# Altium schematic sheet BASE(1).SchDoc
size A4
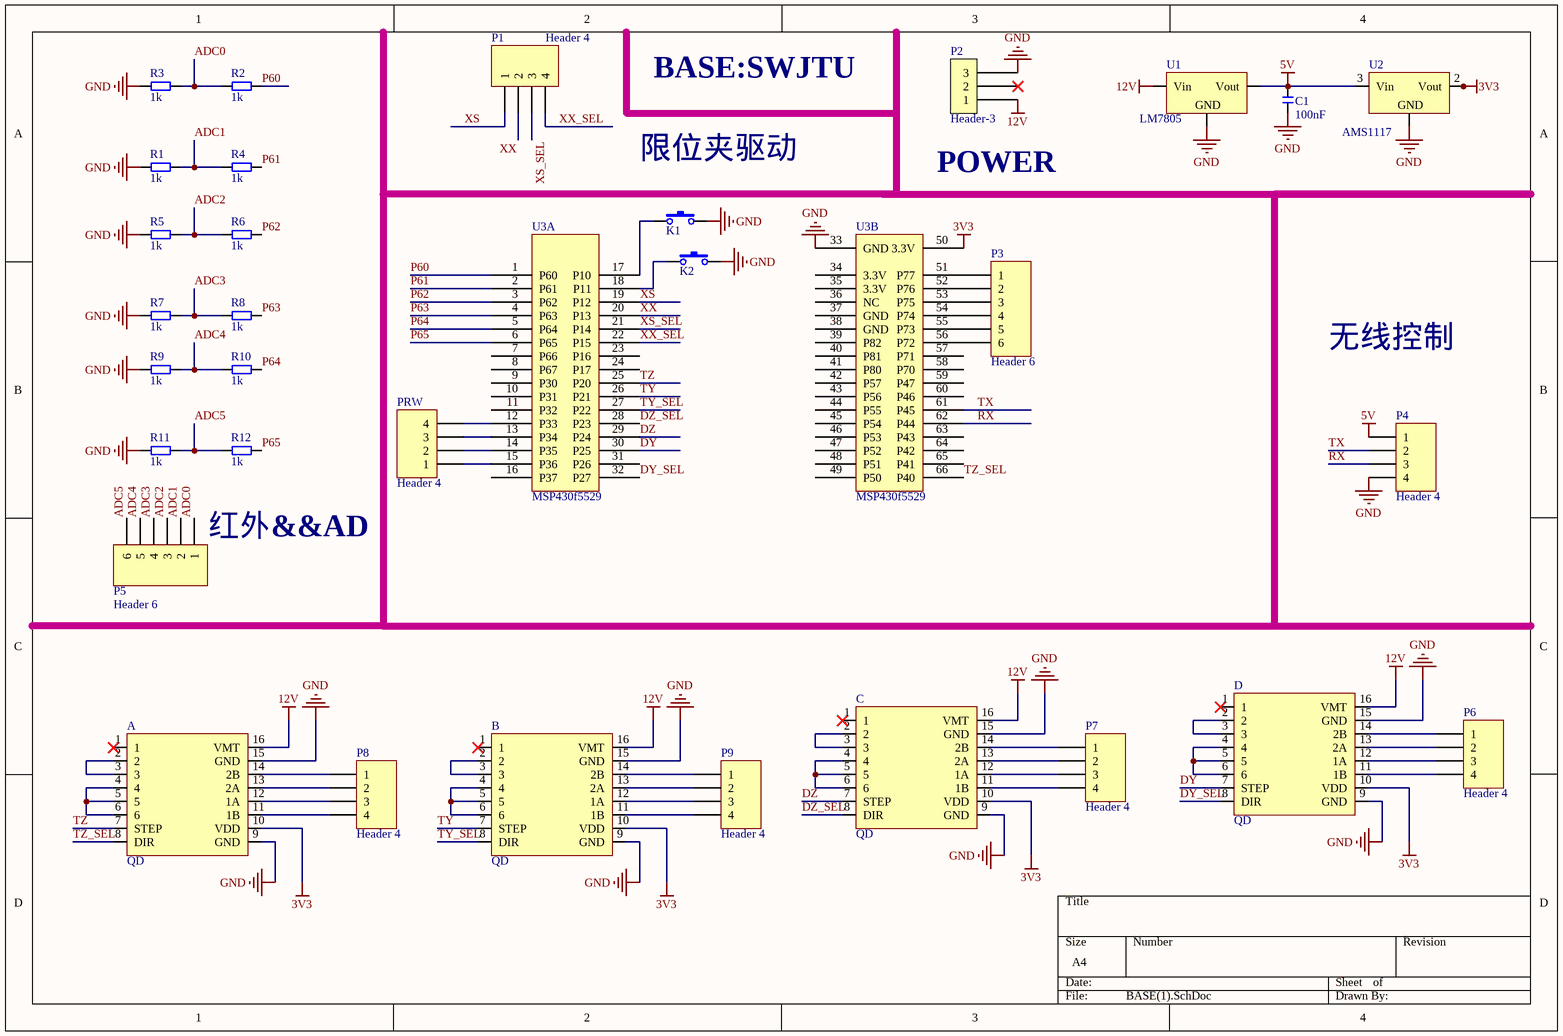
[diagram p0: BASE(1).SchDoc]

## Parts
A  QD  [QD]
B  QD  [QD]
C  QD  [QD]
C1  100nF  [CAP-7.6]
D  QD  [QD]
K1  SW-PB  [SW-4]  (value not drawn)
K2  SW-PB  [SW-4]  (value not drawn)
P1  Header 4  [4PIN-2.54 A]
P2  Header-3  [terminal-03-3]
P3  Header 6  [HDR1X6]
P4  Header 4  [4PIN-2.54 A]
P5  Header 6  [HDR1X6]
P6  Header 4  [4PIN-2.54 A]
P7  Header 4  [4PIN-2.54 A]
P8  Header 4  [4PIN-2.54 A]
P9  Header 4  [4PIN-2.54 A]
PRW  Header 4  [4PIN-2.54 A]
R1  1k  [Axial-0.3-7.62]
R2  1k  [R0805]
R3  1k  [R0805]
R4  1k  [R0805]
R5  1k  [Axial-0.3-7.62]
R6  1k  [R0805]
R7  1k  [Axial-0.3-7.62]
R8  1k  [R0805]
R9  1k  [Axial-0.3-7.62]
R10  1k  [R0805]
R11  1k  [R0805]
R12  1k  [R0805]
U1  LM7805  [TO-220]
U2  AMS1117  [SOT-223]
U3  MSP430f5529  [msp430f5529]  (parts A,B of 2)

## Nets
3V3: A.10(VDD) B.10(VDD) C.10(VDD) D.10(VDD) U2.2(Vout) U2.4(Vout) U3.50(3.3V)
5V: C1.2 P4.1 U1.3(Vout) U2.3(Vin)
12V: A.16(VMT) B.16(VMT) C.16(VMT) D.16(VMT) P2.1 U1.1(Vin)
GND: A.9(GND) A.15(GND) B.9(GND) B.15(GND) C.9(GND) C.15(GND) C1.1 D.9(GND) D.15(GND) K1.2 K2.2 P2.3 P4.4 R1.1 R3.1 R5.1 R7.1 R9.1 R11.1 U1.2(GND) U2.1(GND) U3.33(GND)
ADC0: P5.1 R2.1 R3.2
ADC1: P5.2 R1.2 R4.1
ADC2: P5.3 R5.2 R6.1
ADC3: P5.4 R7.2 R8.1
ADC4: P5.5 R9.2 R10.1
ADC5: P5.6 R11.2 R12.1
DY: D.7(STEP) U3.30(P25)
DY_SEL: D.8(DIR) U3.32(P27)
DZ: C.7(STEP) U3.29(P24)
DZ_SEL: C.8(DIR) U3.28(P23)
P60: R2.2 U3.1(P60)
P61: R4.2 U3.2(P61)
P62: R6.2 U3.3(P62)
P63: R8.2 U3.4(P63)
P64: R10.2 U3.5(P64)
P65: R12.2 U3.6(P65)
RX: P4.3 U3.62(P44)
TX: P4.2 U3.61(P45)
TY: B.7(STEP) U3.26(P21)
TY_SEL: B.8(DIR) U3.27(P22)
TZ: A.7(STEP) U3.25(P20)
TZ_SEL: A.8(DIR) U3.66(P40)
XS: P1.1 U3.19(P12)
XS_SEL: P1.3 U3.21(P14)
XX: P1.2 U3.20(P13)
XX_SEL: P1.4 U3.22(P15)
NetA_2: A.2 A.3
NetA_4: A.4 A.5 A.6
NetA_11: A.11(1B) P8.4
NetA_12: A.12(1A) P8.3
NetA_13: A.13(2A) P8.2
NetA_14: A.14(2B) P8.1
NetB_2: B.2 B.3
NetB_4: B.4 B.5 B.6
NetB_11: B.11(1B) P9.4
NetB_12: B.12(1A) P9.3
NetB_13: B.13(2A) P9.2
NetB_14: B.14(2B) P9.1
NetC_2: C.2 C.3
NetC_4: C.4 C.5 C.6
NetC_11: C.11(1B) P7.4
NetC_12: C.12(1A) P7.3
NetC_13: C.13(2A) P7.2
NetC_14: C.14(2B) P7.1
NetD_2: D.2 D.3
NetD_4: D.4 D.5 D.6
NetD_11: D.11(1B) P6.4
NetD_12: D.12(1A) P6.3
NetD_13: D.13(2A) P6.2
NetD_14: D.14(2B) P6.1
NetK1_1: K1.1 U3.17(P10)
NetK2_1: K2.1 U3.18(P11)
NetP3_1: P3.1 U3.51(P77)
NetP3_2: P3.2 U3.52(P76)
NetP3_3: P3.3 U3.53(P75)
NetP3_4: P3.4 U3.54(P74)
NetP3_5: P3.5 U3.55(P73)
NetP3_6: P3.6 U3.56(P72)
NetPRW_1: PRW.1 U3.15(P36)
NetPRW_2: PRW.2 U3.14(P35)
NetPRW_3: PRW.3 U3.13(P34)
NetPRW_4: PRW.4 U3.12(P33)

Not connected (* = marked no-connect by the designer): A 1*; B 1*; C 1*; D 1*; P2 2*; U3 7(P66) 8(P67) 9(P30) 10(P31) 11(P32) 16(P37) 23(P16) 24(P17) 31(P26) 34(3.3V) 35(3.3V) 36(NC) 37(GND) 38(GND) 39(P82) 40(P81) 41(P80) 42(P57) 43(P56) 44(P55) 45(P54) 46(P53) 47(P52) 48(P51) 49(P50) 57(P71) 58(P70) 59(P47) 60(P46) 63(P43) 64(P42) 65(P41)

## Notes on the sheet
- BASE:SWJTU
- 限位夹驱动
- POWER
- 无线控制
- (near P5) 红外&&AD

## Library data of the parts
C1 = Cap: 无极电容; Value: 100nF
K1 K2 = SW-PB: 轻触开关
P1 P4 P6-P9 PRW = Header 4: Header, 4-Pin; LatestRevisionDate: 17-Jul-2002; LatestRevisionNote: Re-released for DXP Platform.; Publisher: Altium Limited
P2 = Header-3: 三针插座
P3 P5 = Header 6: Header, 6-Pin; LatestRevisionDate: 17-Jul-2002; LatestRevisionNote: Re-released for DXP Platform.; Publisher: Altium Limited
R1-R12 = RES: 电阻  RES; Value: 1k
U1 = LM78XX: 三端稳压器
U2 = AMS1117: LDO